# Altium schematic sheet Supply.SchDoc
size A4; SheetNumber: 1; SheetTotal: 10
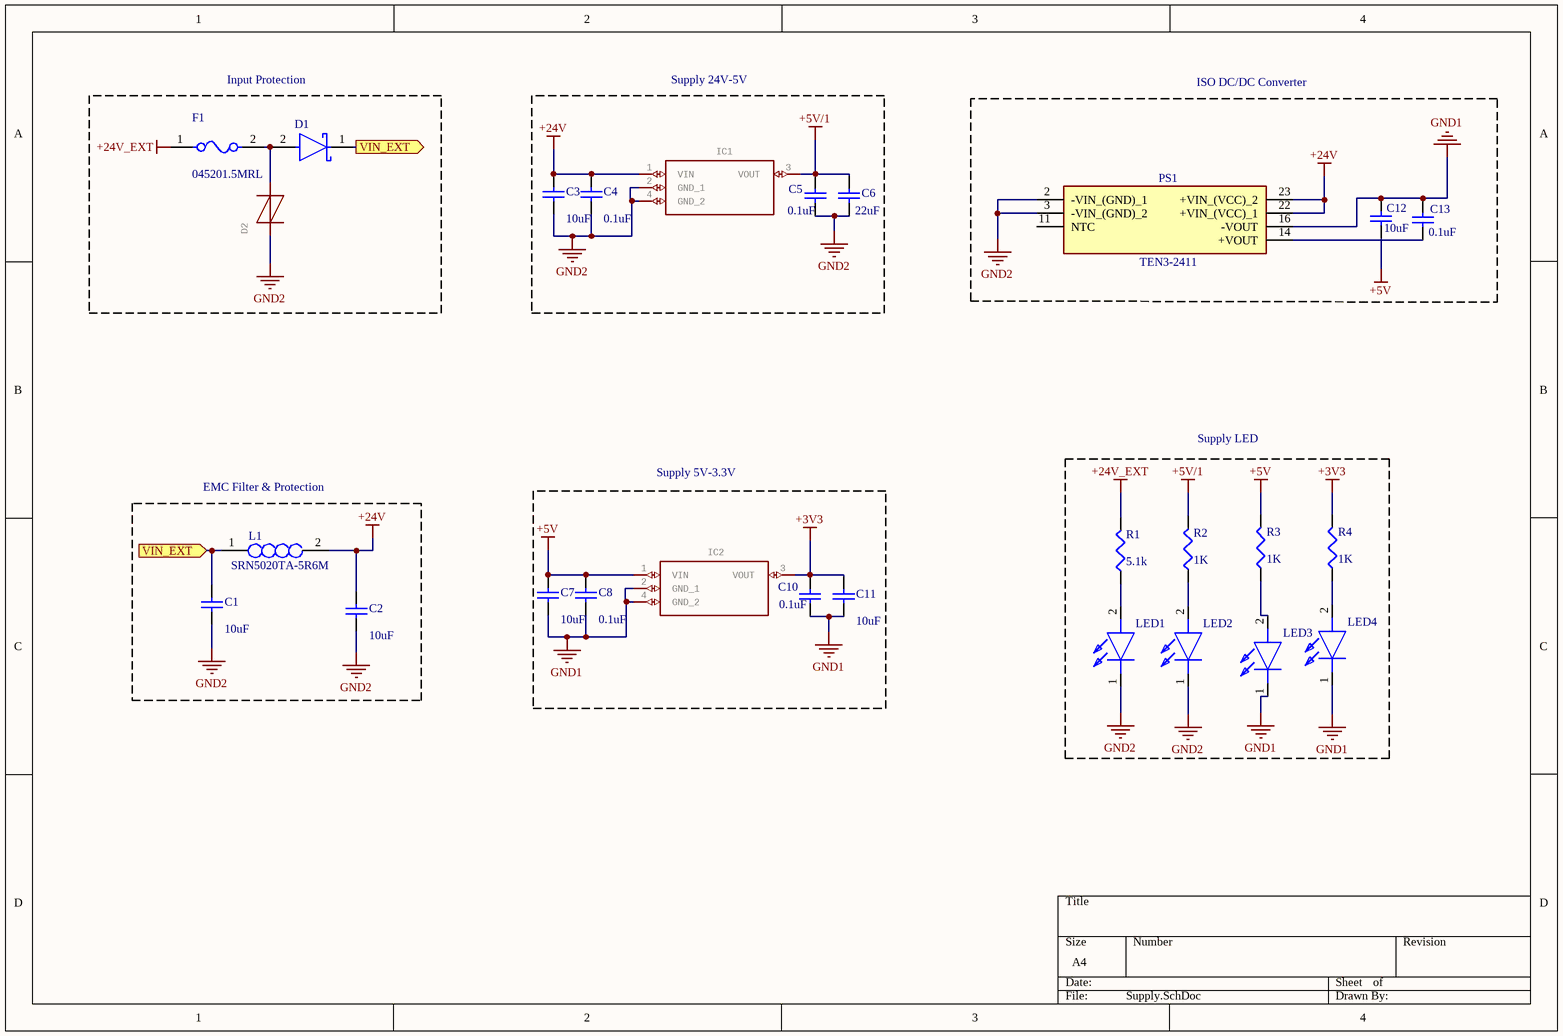
[diagram p0: Supply.SchDoc]

## Parts
C1  value 10uF  [1608[0603]]  (hidden comment: Cap Semi)
C2  value 10uF  [1608[0603]]  (hidden comment: Cap Semi)
C3  value 10uF  [1608[0603]]  (hidden comment: Cap Semi)
C4  value 0.1uF  [1608[0603]]  (hidden comment: Cap Semi)
C5  value 0.1uF  [1608[0603]]  (hidden comment: Cap Semi)
C6  value 22uF  [1608[0603]]  (hidden comment: Cap Semi)
C7  value 10uF  [1608[0603]]  (hidden comment: Cap Semi)
C8  value 0.1uF  [1608[0603]]  (hidden comment: Cap Semi)
C10  value 0.1uF  [1608[0603]]  (hidden comment: Cap Semi)
C11  value 10uF  [1608[0603]]  (hidden comment: Cap Semi)
C12  value 10uF  [C1206]  (hidden comment: Cap Semi)
C13  value 0.1uF  [C1206]  (hidden comment: Cap Semi)
D1  NRVTSS5100ET3G  [FP-403A-03-MFG]  (value not drawn)
D2  Thyristor Surge Protection Devices (TSPD) 500A 25V  [LIBRARY_DIODES_FUSE_SMB]  (value not drawn)
F1  045201.5MRL  [FP-0452-MFG]
IC1  LDO LDO Voltage Regulators 5.0V/400MA LDO + Tab-Pin SOT-223  [SOT223]  (value not drawn)
IC2  LDO Regulator 3.3V 1% 300mA SOT223 ON Semiconductor MC33275ST-3.3T3G, LDO Voltage Regulator, 300mA, 3.3 V, Maximum of 13 Vin, 3 + Tab-Pin SOT-223   Source:  Datasheet  [SOT223]  (value not drawn)
L1  SRN5020TA-5R6M  [INDPM5050X200N]
LED1  SML-D12D1WT86  [LEDC1608X55N]  (value not drawn)
LED2  SML-D12D1WT86  [LEDC1608X55N]  (value not drawn)
LED3  SML-D12D1WT86  [LEDC1608X55N]  (value not drawn)
LED4  SML-D12D1WT86  [LEDC1608X55N]  (value not drawn)
PS1  TEN3-2411  [TEN30515N]
R1  value 5.1k  [J1-0603]  (hidden comment: Res3)
R2  value 1K  [J1-0603]  (hidden comment: Res3)
R3  value 1K  [J1-0603]  (hidden comment: Res3)
R4  value 1K  [J1-0603]  (hidden comment: Res3)

## Blocks framed on the sheet
Input Protection: D1 D2 F1
Supply 24V-5V: C3-C6 IC1
ISO DC/DC Converter: C12 C13 PS1
Supply LED: LED1-LED4 R1-R4
EMC Filter & Protection: C1 C2 L1
Supply 5V-3.3V: C7 C8 C10 C11 IC2

## Ports
VIN_EXT (in), VIN_EXT (out)

## Nets
+3V3: C10.2 C11.2 IC2.3(VOUT) R4.2
+5V: C7.2 C8.2 C12.1 IC2.1(VIN) R3.2
+5V/1: C5.2 C6.2 IC1.3(VOUT) R2.2
+24V: C2.2 C3.2 C4.2 IC1.1(VIN) L1.2 PS1.22(+VIN_(VCC)_1) PS1.23(+VIN_(VCC)_2)
+24V_EXT: F1.1 R1.2
GND1: C7.1 C8.1 C10.1 C11.1 C12.2 C13.2 IC2.2(GND_1) IC2.4(GND_2) LED3.1(K) LED4.1(K) PS1.16(-VOUT)
GND2: C1.1 C2.1 C3.1 C4.1 C5.1 C6.1 D2.2(T) IC1.2(GND_1) IC1.4(GND_2) LED1.1(K) LED2.1(K) PS1.2(-VIN_(GND)_1) PS1.3(-VIN_(GND)_2)
VIN_EXT: C1.2 D1.1(C) L1.1 ; port VIN_EXT
NetC13_1: C13.1 PS1.14(+VOUT)
NetD1_2: D1.2(A) D2.1(R) F1.2
NetLED1_2: LED1.2(A) R1.1
NetLED2_2: LED2.2(A) R2.1
NetLED3_2: LED3.2(A) R3.1
NetLED4_2: LED4.2(A) R4.1

Not connected (* = marked no-connect by the designer): PS1 11(NTC)

## Library data of the parts
C1-C8 C10-C13 = Cap Semi: Capacitor (Semiconductor SIM Model); Published: 8-Jun-2000; LatestRevisionDate: 29-May-2009; LatestRevisionNote: IPC-7351 Footprint Added.; PackageReference: C1206; Publisher: Altium Limited; PackageDescription: Chip Capacitor
D1 = CMP-07162-000014-1: Trench Schottky Rectifier, Very Low Leakage, 100V, 5A,; Manufacturer: ON Semiconductor; Max Junction Temp: +175°C; Standoff Height: 0.05mm; Peak Reverse Current: 2.6uA; Automotive Grade: Grade 0; Max Surge Forward Current: 50A; Capacitance: 54.5pF; Value: 54.5pF; Category: Diode; Forward Current: 5A; ComponentLink2Description: Datasheet; Reverse Voltage: 100V; Manufacturer Part Number: NRVTSS5100ET3G; Automotive: Yes; ComponentLink2URL: https://www.onsemi.com/pub/Collateral/NRVTSS5100E-D.PDF; Device Class L1: Discrete Semiconductors; Height: 2.47mm; Temperature Range Low: -55°C; Footprint Url: https://www.onsemi.com/pub/Collateral/403A-03.PDF; Lead Free: Yes; Temperature Range High: +175°C; RoHS: TRUE; Temperature: -55°C to +175°C; Device Class L3: Schottky Diodes; Package: 403A-03; Octopart: https://octopart.com/nrvtss5100et3g-on+semiconductor-54318003; Max Repetitive Reverse Voltage: 100V; Device Class L2: Diodes; Mouser Description: Trench Schottky Rectifier, Very Low Leakage, 100V, 5A,
D2 = P0300SCLRP: GateName_1: G$1; SymbolName_1: LIBRARY_DIODES_FUSE_TISP4040H1BJR-S; LibraryName: COMPAQ; DeviceSetName: P0300SCLRP; Package: LIBRARY_DIODES_FUSE_SMB
F1 = CMP-08605-000038-1: FUSE BRD MNT 1.5A 125VAC/VDC SMD; Manufacturer: Littelfuse Inc; Value: 0.093Ω; Fuse Interrupt Ac Current: 50A; Max Fuse Dc Voltage: 125V; Fuse Blow Speed: Slow; Fuse I2T: 3.65A2Sec; Fuse Interrupt Dc Current: 300A; Device Class L2: Fuses; Device Class L3: unset; Temperature Range High: +125°C; Manufacturer Part Number: 045201.5MRL; Temperature: -55°C to +125°C; Fuse Current: 1.5A; ComponentLink2Description: Datasheet; Temperature Range Low: -55°C; Resistance: 0.093Ω; Package: 0452; RoHS: TRUE; Max Fuse Ac Voltage: 125V; Category: Fuse; Mouser Description: Surface Mount Fuses 125V 1.5A; Device Class L1: Circuit Protection; Octopart: https://octopart.com/045201.5mrl-littelfuse-566412; ComponentLink2URL: https://www.littelfuse.com/~/media/electronics/datasheets/fuses/littelfuse_fuse_452_454_datasheet.pdf.pdf; Lead Free: Yes; Automotive: No; Height: 2.94mm; Digikey Description: FUSE BRD MNT 1.5A 125VAC/VDC SMD; Voltage Rating: 125V
IC1 = NCV4274CST50T3G: GateName_1: G$1; SymbolName_1: MC33275ST-3.3T3G; LibraryName: COMPAQ; DeviceSetName: NCV4274CST50T3G; Package: SOT223
IC2 = MC33275ST-3.3T3G: GateName_1: G$1; SymbolName_1: MC33275ST-3.3T3G; LibraryName: COMPAQ; DeviceSetName: MC33275ST-3.3T3G; Package: SOT223
L1 = SRN5020TA-5R6M: Inductor; Manufacturer_Name: Bourns; Datasheet Link: https://www.arrow.com/en/products/srn5020ta-5r6m/bourns; Height: 2mm; Manufacturer_Part_Number: SRN5020TA-5R6M; Mouser Part Number: 652-SRN5020TA-5R6M; Mouser Price/Stock: https://www.mouser.com/Search/Refine.aspx?Keyword=652-SRN5020TA-5R6M; Arrow Part Number: SRN5020TA-5R6M; Arrow Price/Stock: https://www.arrow.com/en/products/srn5020ta-5r6m/bourns
LED1-LED4 = SML-D12D1WT86: LED; Manufacturer_Name: ROHM Semiconductor; Datasheet Link: https://www.rohm.com/datasheet/SML-D12D1W/sml-d12x1-e; Height: 0.55mm; Manufacturer_Part_Number: SML-D12D1WT86; Mouser Part Number: 755-SML-D12D1WT86; Mouser Price/Stock: https://www.mouser.co.uk/ProductDetail/ROHM-Semiconductor/SML-D12D1WT86/?qs=M3jcYzEJUdEqFdUV5eljZg%3D%3D
PS1 = TEN3-2411: Power Supply; Manufacturer_Name: Traco Power; Datasheet Link: https://www.tracopower.com/products/ten3.pdf; Height: 10.7mm; Manufacturer_Part_Number: TEN3-2411
R1-R4 = Res3: Resistor; Published: 8-Jun-2000; LatestRevisionDate: 29-May-2009; LatestRevisionNote: IPC-7351 Footprint Added.; PackageReference: J1-0603; Publisher: Altium Limited; PackageDescription: Chip Resistor